# Altium project Pleiades_P01.PrjPcb (part 2 of 10)

## Sheet DDR3.SchDoc
size 558 x 431 mm; SheetNumber: 6; SheetTotal: 23; Sheet_Name: DDR3; Size: 11x17
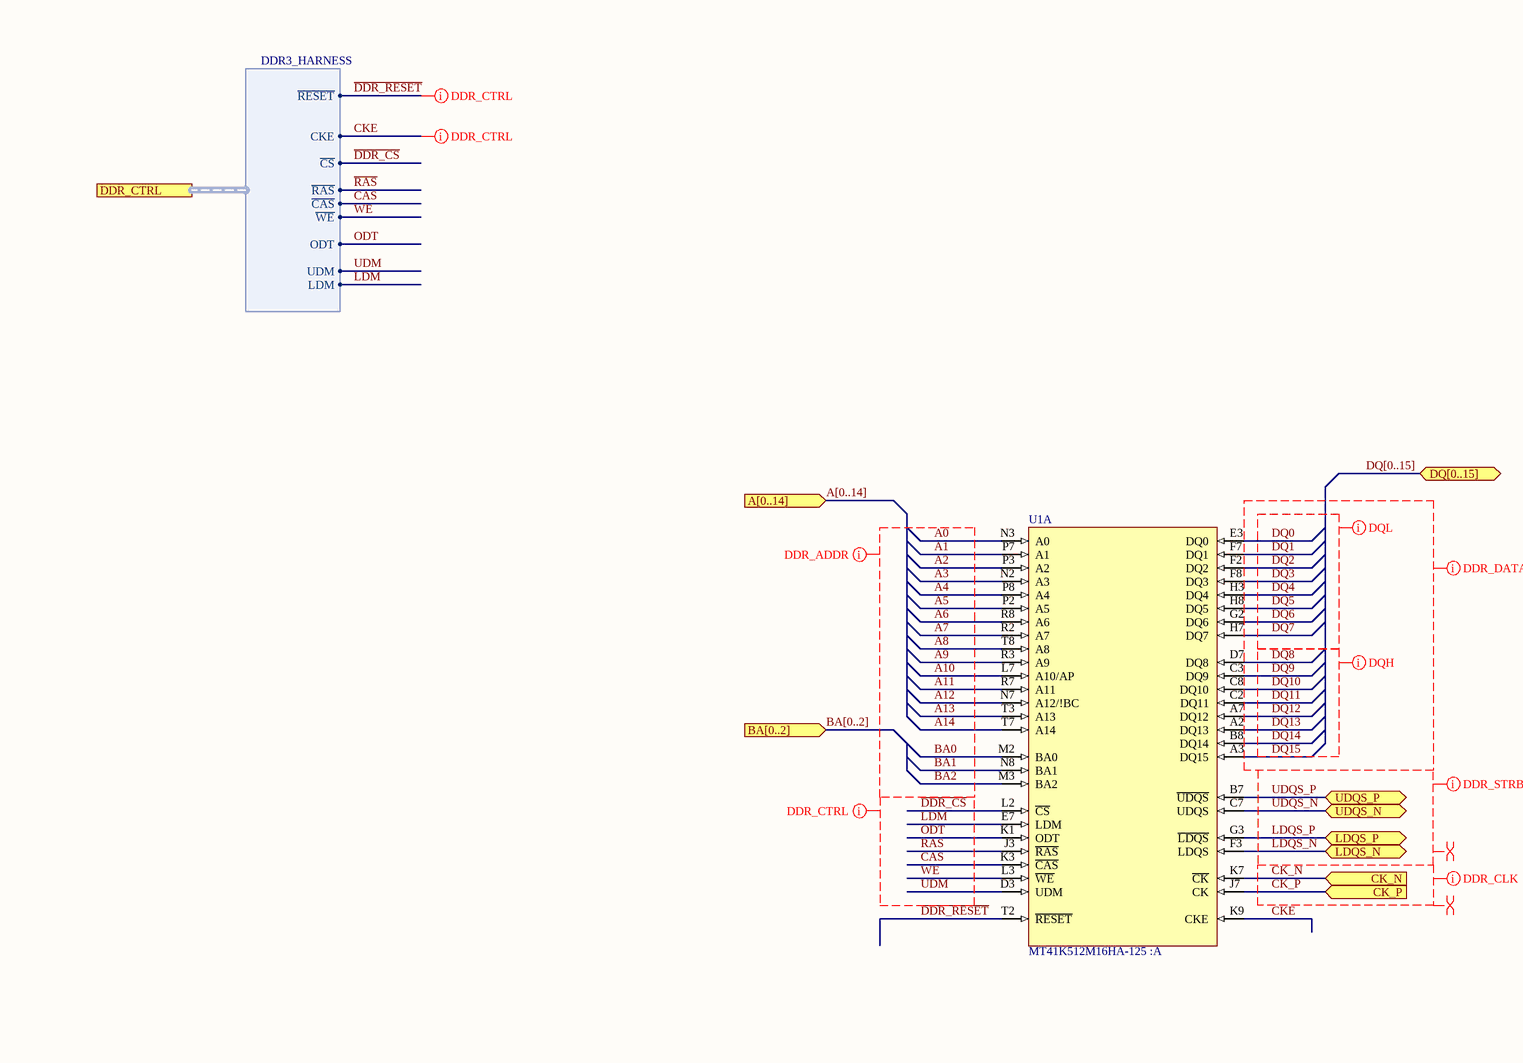
[diagram p10: DDR3.SchDoc, top left]
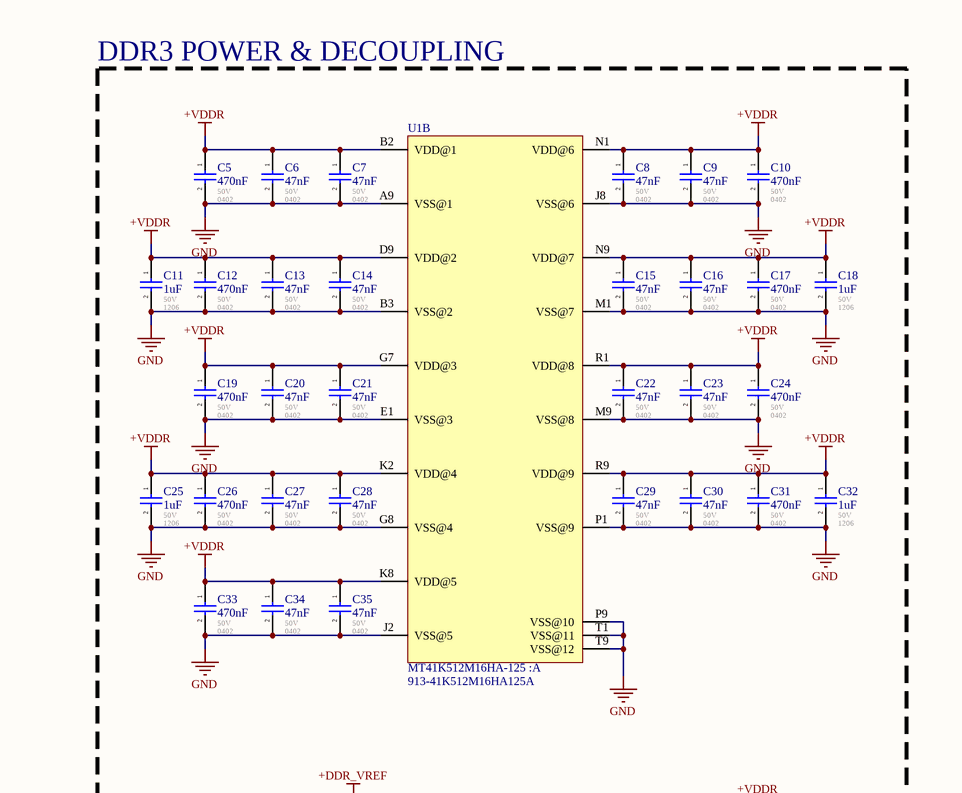
[diagram p11: DDR3.SchDoc, top right]
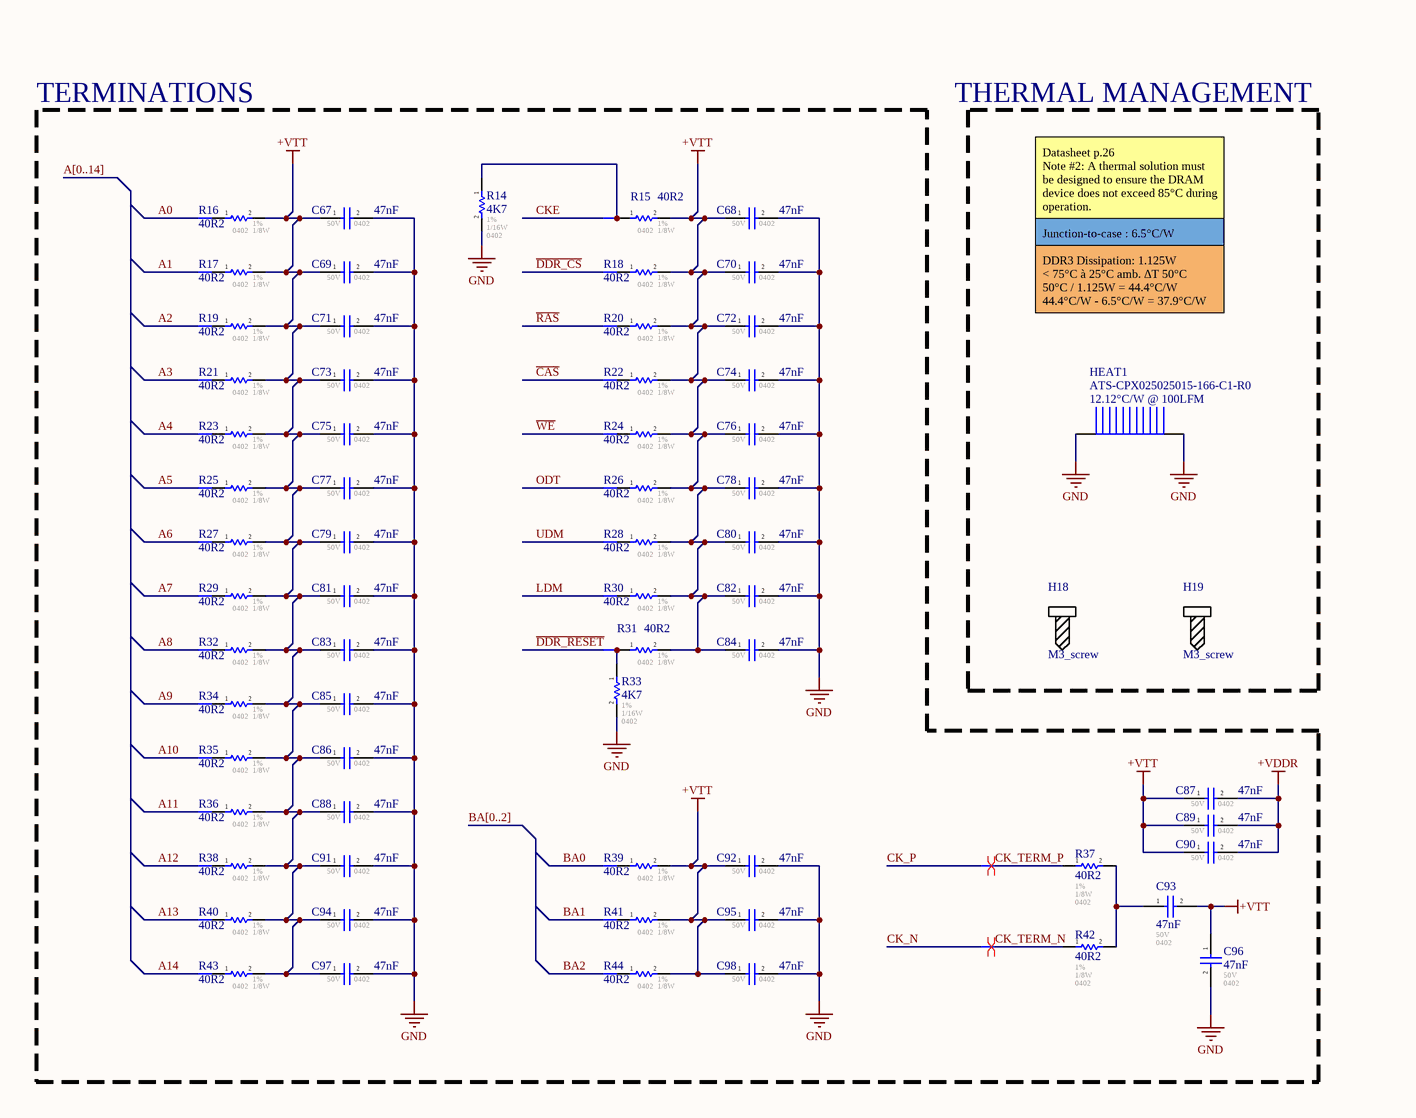
[diagram p12: DDR3.SchDoc, bottom left]
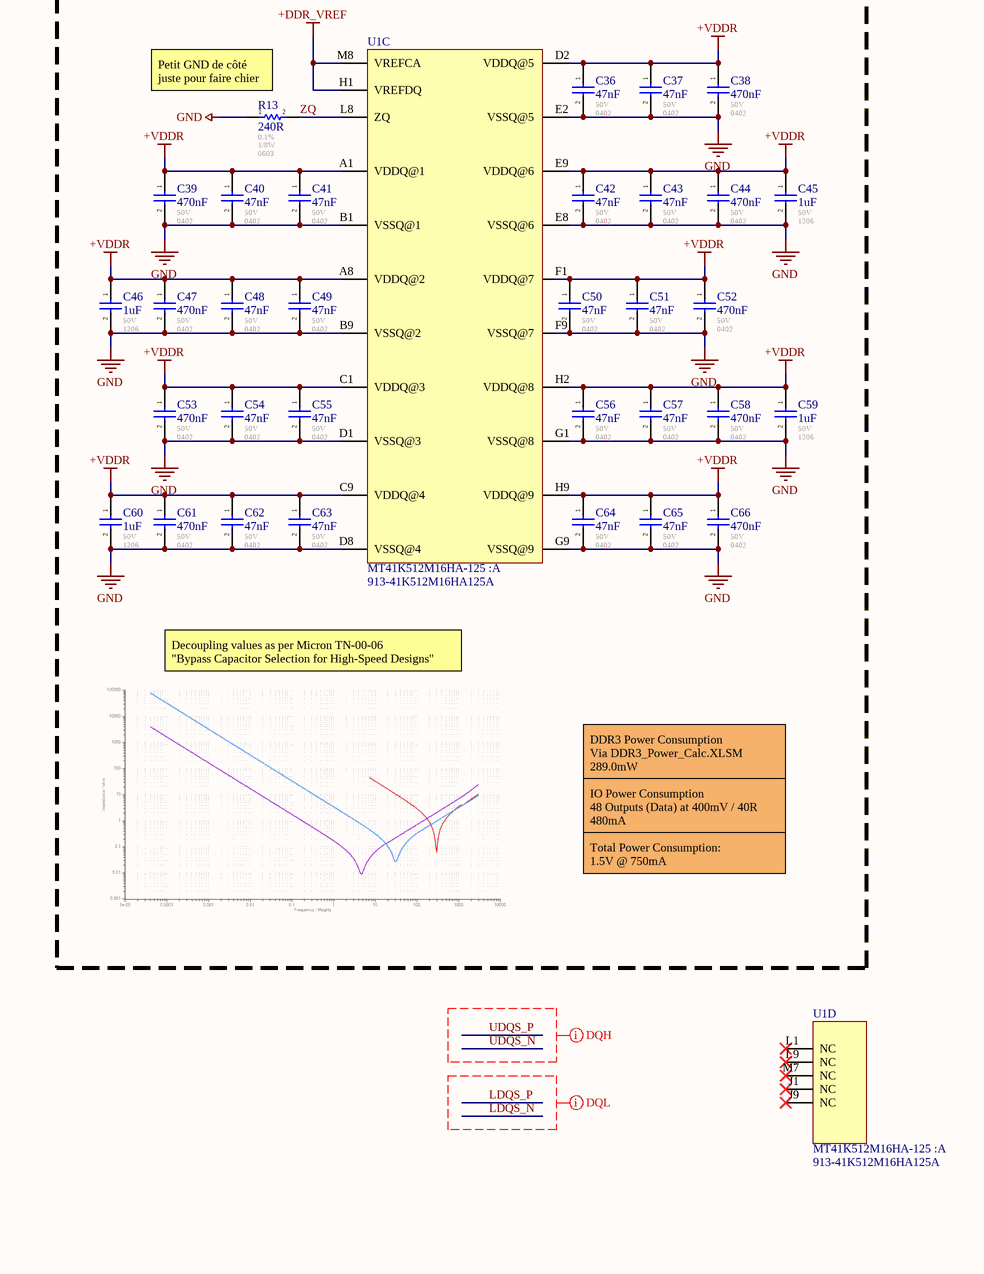
[diagram p13: DDR3.SchDoc, bottom right]

### Parts
C5  470nF  Voltage - Rated: 50V  Footprint: 0402  [CAP_0402]
C6  47nF  Voltage - Rated: 50V  Footprint: 0402  [CAP_0402]
C7  47nF  Voltage - Rated: 50V  Footprint: 0402  [CAP_0402]
C8  47nF  Voltage - Rated: 50V  Footprint: 0402  [CAP_0402]
C9  47nF  Voltage - Rated: 50V  Footprint: 0402  [CAP_0402]
C10  470nF  Voltage - Rated: 50V  Footprint: 0402  [CAP_0402]
C11  1uF  Voltage - Rated: 50V  Footprint: 1206  [CAP_1206]
C12  470nF  Voltage - Rated: 50V  Footprint: 0402  [CAP_0402]
C13  47nF  Voltage - Rated: 50V  Footprint: 0402  [CAP_0402]
C14  47nF  Voltage - Rated: 50V  Footprint: 0402  [CAP_0402]
C15  47nF  Voltage - Rated: 50V  Footprint: 0402  [CAP_0402]
C16  47nF  Voltage - Rated: 50V  Footprint: 0402  [CAP_0402]
C17  470nF  Voltage - Rated: 50V  Footprint: 0402  [CAP_0402]
C18  1uF  Voltage - Rated: 50V  Footprint: 1206  [CAP_1206]
C19  470nF  Voltage - Rated: 50V  Footprint: 0402  [CAP_0402]
C20  47nF  Voltage - Rated: 50V  Footprint: 0402  [CAP_0402]
C21  47nF  Voltage - Rated: 50V  Footprint: 0402  [CAP_0402]
C22  47nF  Voltage - Rated: 50V  Footprint: 0402  [CAP_0402]
C23  47nF  Voltage - Rated: 50V  Footprint: 0402  [CAP_0402]
C24  470nF  Voltage - Rated: 50V  Footprint: 0402  [CAP_0402]
C25  1uF  Voltage - Rated: 50V  Footprint: 1206  [CAP_1206]
C26  470nF  Voltage - Rated: 50V  Footprint: 0402  [CAP_0402]
C27  47nF  Voltage - Rated: 50V  Footprint: 0402  [CAP_0402]
C28  47nF  Voltage - Rated: 50V  Footprint: 0402  [CAP_0402]
C29  47nF  Voltage - Rated: 50V  Footprint: 0402  [CAP_0402]
C30  47nF  Voltage - Rated: 50V  Footprint: 0402  [CAP_0402]
C31  470nF  Voltage - Rated: 50V  Footprint: 0402  [CAP_0402]
C32  1uF  Voltage - Rated: 50V  Footprint: 1206  [CAP_1206]
C33  470nF  Voltage - Rated: 50V  Footprint: 0402  [CAP_0402]
C34  47nF  Voltage - Rated: 50V  Footprint: 0402  [CAP_0402]
C35  47nF  Voltage - Rated: 50V  Footprint: 0402  [CAP_0402]
C36  47nF  Voltage - Rated: 50V  Footprint: 0402  [CAP_0402]
C37  47nF  Voltage - Rated: 50V  Footprint: 0402  [CAP_0402]
C38  470nF  Voltage - Rated: 50V  Footprint: 0402  [CAP_0402]
C39  470nF  Voltage - Rated: 50V  Footprint: 0402  [CAP_0402]
C40  47nF  Voltage - Rated: 50V  Footprint: 0402  [CAP_0402]
C41  47nF  Voltage - Rated: 50V  Footprint: 0402  [CAP_0402]
C42  47nF  Voltage - Rated: 50V  Footprint: 0402  [CAP_0402]
C43  47nF  Voltage - Rated: 50V  Footprint: 0402  [CAP_0402]
C44  470nF  Voltage - Rated: 50V  Footprint: 0402  [CAP_0402]
C45  1uF  Voltage - Rated: 50V  Footprint: 1206  [CAP_1206]
C46  1uF  Voltage - Rated: 50V  Footprint: 1206  [CAP_1206]
C47  470nF  Voltage - Rated: 50V  Footprint: 0402  [CAP_0402]
C48  47nF  Voltage - Rated: 50V  Footprint: 0402  [CAP_0402]
C49  47nF  Voltage - Rated: 50V  Footprint: 0402  [CAP_0402]
C50  47nF  Voltage - Rated: 50V  Footprint: 0402  [CAP_0402]
C51  47nF  Voltage - Rated: 50V  Footprint: 0402  [CAP_0402]
C52  470nF  Voltage - Rated: 50V  Footprint: 0402  [CAP_0402]
C53  470nF  Voltage - Rated: 50V  Footprint: 0402  [CAP_0402]
C54  47nF  Voltage - Rated: 50V  Footprint: 0402  [CAP_0402]
C55  47nF  Voltage - Rated: 50V  Footprint: 0402  [CAP_0402]
C56  47nF  Voltage - Rated: 50V  Footprint: 0402  [CAP_0402]
C57  47nF  Voltage - Rated: 50V  Footprint: 0402  [CAP_0402]
C58  470nF  Voltage - Rated: 50V  Footprint: 0402  [CAP_0402]
C59  1uF  Voltage - Rated: 50V  Footprint: 1206  [CAP_1206]
C60  1uF  Voltage - Rated: 50V  Footprint: 1206  [CAP_1206]
C61  470nF  Voltage - Rated: 50V  Footprint: 0402  [CAP_0402]
C62  47nF  Voltage - Rated: 50V  Footprint: 0402  [CAP_0402]
C63  47nF  Voltage - Rated: 50V  Footprint: 0402  [CAP_0402]
C64  47nF  Voltage - Rated: 50V  Footprint: 0402  [CAP_0402]
C65  47nF  Voltage - Rated: 50V  Footprint: 0402  [CAP_0402]
C66  470nF  Voltage - Rated: 50V  Footprint: 0402  [CAP_0402]
C67  47nF  Voltage - Rated: 50V  Footprint: 0402  [CAP_0402]
C68  47nF  Voltage - Rated: 50V  Footprint: 0402  [CAP_0402]
C69  47nF  Voltage - Rated: 50V  Footprint: 0402  [CAP_0402]
C70  47nF  Voltage - Rated: 50V  Footprint: 0402  [CAP_0402]
C71  47nF  Voltage - Rated: 50V  Footprint: 0402  [CAP_0402]
C72  47nF  Voltage - Rated: 50V  Footprint: 0402  [CAP_0402]
C73  47nF  Voltage - Rated: 50V  Footprint: 0402  [CAP_0402]
C74  47nF  Voltage - Rated: 50V  Footprint: 0402  [CAP_0402]
C75  47nF  Voltage - Rated: 50V  Footprint: 0402  [CAP_0402]
C76  47nF  Voltage - Rated: 50V  Footprint: 0402  [CAP_0402]
C77  47nF  Voltage - Rated: 50V  Footprint: 0402  [CAP_0402]
C78  47nF  Voltage - Rated: 50V  Footprint: 0402  [CAP_0402]
C79  47nF  Voltage - Rated: 50V  Footprint: 0402  [CAP_0402]
C80  47nF  Voltage - Rated: 50V  Footprint: 0402  [CAP_0402]
C81  47nF  Voltage - Rated: 50V  Footprint: 0402  [CAP_0402]
C82  47nF  Voltage - Rated: 50V  Footprint: 0402  [CAP_0402]
C83  47nF  Voltage - Rated: 50V  Footprint: 0402  [CAP_0402]
C84  47nF  Voltage - Rated: 50V  Footprint: 0402  [CAP_0402]
C85  47nF  Voltage - Rated: 50V  Footprint: 0402  [CAP_0402]
C86  47nF  Voltage - Rated: 50V  Footprint: 0402  [CAP_0402]
C87  47nF  Voltage - Rated: 50V  Footprint: 0402  [CAP_0402]
C88  47nF  Voltage - Rated: 50V  Footprint: 0402  [CAP_0402]
C89  47nF  Voltage - Rated: 50V  Footprint: 0402  [CAP_0402]
C90  47nF  Voltage - Rated: 50V  Footprint: 0402  [CAP_0402]
C91  47nF  Voltage - Rated: 50V  Footprint: 0402  [CAP_0402]
C92  47nF  Voltage - Rated: 50V  Footprint: 0402  [CAP_0402]
C93  47nF  Voltage - Rated: 50V  Footprint: 0402  [CAP_0402]
C94  47nF  Voltage - Rated: 50V  Footprint: 0402  [CAP_0402]
C95  47nF  Voltage - Rated: 50V  Footprint: 0402  [CAP_0402]
C96  47nF  Voltage - Rated: 50V  Footprint: 0402  [CAP_0402]
C97  47nF  Voltage - Rated: 50V  Footprint: 0402  [CAP_0402]
C98  47nF  Voltage - Rated: 50V  Footprint: 0402  [CAP_0402]
H18  M3_screw  (mechanical)
H19  M3_screw  (mechanical)
HEAT1  ATS-CPX025025015-166-C1-R0  Thermal Resistance: 12.12°C/W @ 100LFM  [ATS-CPX025025015-166-C1-R0]
NT1  Net Tie  [NETTIE_9]  (value not drawn)  (net tie, no BOM)
NT2  Net Tie  [NETTIE_9]  (value not drawn)  (net tie, no BOM)
NT3  Net Tie  [NETTIE_9]  (value not drawn)  (net tie, no BOM)
NT4  Net Tie  [NETTIE_9]  (value not drawn)  (net tie, no BOM)
NT5  Net Tie  [NETTIE_9]  (value not drawn)  (net tie, no BOM)
NT6  Net Tie  [NETTIE_9]  (value not drawn)  (net tie, no BOM)
NT7  Net Tie  [NETTIE_9]  (value not drawn)  (net tie, no BOM)
NT8  Net Tie  [NETTIE_9]  (value not drawn)  (net tie, no BOM)
NT9  Net Tie  [NETTIE_9]  (value not drawn)  (net tie, no BOM)
NT10  Net Tie  [NETTIE_9]  (value not drawn)  (net tie, no BOM)
NT11  Net Tie  [NETTIE_9]  (value not drawn)  (net tie, no BOM)
NT12  Net Tie  [NETTIE_9]  (value not drawn)  (net tie, no BOM)
NT13  Net Tie  [NETTIE_9]  (value not drawn)  (net tie, no BOM)
NT14  Net Tie  [NETTIE_9]  (value not drawn)  (net tie, no BOM)
NT15  Net Tie  [NETTIE_9]  (value not drawn)  (net tie, no BOM)
NT16  Net Tie  [NETTIE_9]  (value not drawn)  (net tie, no BOM)
NT17  Net Tie  [NETTIE_9]  (value not drawn)  (net tie, no BOM)
NT18  Net Tie  [NETTIE_9]  (value not drawn)  (net tie, no BOM)
NT19  Net Tie  [NETTIE_9]  (value not drawn)  (net tie, no BOM)
NT20  Net Tie  [NETTIE_9]  (value not drawn)  (net tie, no BOM)
NT21  Net Tie  [NETTIE_9]  (value not drawn)  (net tie, no BOM)
NT22  Net Tie  [NETTIE_9]  (value not drawn)  (net tie, no BOM)
NT23  Net Tie  [NETTIE_9]  (value not drawn)  (net tie, no BOM)
NT24  Net Tie  [NETTIE_9]  (value not drawn)  (net tie, no BOM)
NT25  Net Tie  [NETTIE_9]  (value not drawn)  (net tie, no BOM)
NT26  Net Tie  [NETTIE_9]  (value not drawn)  (net tie, no BOM)
NT27  Net Tie  [NETTIE_9]  (value not drawn)  (net tie, no BOM)
NT28  Net Tie  [NETTIE_9]  (value not drawn)  (net tie, no BOM)
NT29  Net Tie  [NETTIE_9]  (value not drawn)  (net tie, no BOM)
R13  240R  Tolerance: 0.1%  Power: 1/8W  Package / Case: 0603  [RES_0603]
R14  4K7  Tolerance: 1%  Power: 1/16W  Package / Case: 0402  [RES_0402]
R15  40R2  Tolerance: 1%  Power: 1/8W  Package / Case: 0402  [RES_0402]
R16  40R2  Tolerance: 1%  Power: 1/8W  Package / Case: 0402  [RES_0402]
R17  40R2  Tolerance: 1%  Power: 1/8W  Package / Case: 0402  [RES_0402]
R18  40R2  Tolerance: 1%  Power: 1/8W  Package / Case: 0402  [RES_0402]
R19  40R2  Tolerance: 1%  Power: 1/8W  Package / Case: 0402  [RES_0402]
R20  40R2  Tolerance: 1%  Power: 1/8W  Package / Case: 0402  [RES_0402]
R21  40R2  Tolerance: 1%  Power: 1/8W  Package / Case: 0402  [RES_0402]
R22  40R2  Tolerance: 1%  Power: 1/8W  Package / Case: 0402  [RES_0402]
R23  40R2  Tolerance: 1%  Power: 1/8W  Package / Case: 0402  [RES_0402]
R24  40R2  Tolerance: 1%  Power: 1/8W  Package / Case: 0402  [RES_0402]
R25  40R2  Tolerance: 1%  Power: 1/8W  Package / Case: 0402  [RES_0402]
R26  40R2  Tolerance: 1%  Power: 1/8W  Package / Case: 0402  [RES_0402]
R27  40R2  Tolerance: 1%  Power: 1/8W  Package / Case: 0402  [RES_0402]
R28  40R2  Tolerance: 1%  Power: 1/8W  Package / Case: 0402  [RES_0402]
R29  40R2  Tolerance: 1%  Power: 1/8W  Package / Case: 0402  [RES_0402]
R30  40R2  Tolerance: 1%  Power: 1/8W  Package / Case: 0402  [RES_0402]
R31  40R2  Tolerance: 1%  Power: 1/8W  Package / Case: 0402  [RES_0402]
R32  40R2  Tolerance: 1%  Power: 1/8W  Package / Case: 0402  [RES_0402]
R33  4K7  Tolerance: 1%  Power: 1/16W  Package / Case: 0402  [RES_0402]
R34  40R2  Tolerance: 1%  Power: 1/8W  Package / Case: 0402  [RES_0402]
R35  40R2  Tolerance: 1%  Power: 1/8W  Package / Case: 0402  [RES_0402]
R36  40R2  Tolerance: 1%  Power: 1/8W  Package / Case: 0402  [RES_0402]
R37  40R2  Tolerance: 1%  Power: 1/8W  Package / Case: 0402  [RES_0402]
R38  40R2  Tolerance: 1%  Power: 1/8W  Package / Case: 0402  [RES_0402]
R39  40R2  Tolerance: 1%  Power: 1/8W  Package / Case: 0402  [RES_0402]
R40  40R2  Tolerance: 1%  Power: 1/8W  Package / Case: 0402  [RES_0402]
R41  40R2  Tolerance: 1%  Power: 1/8W  Package / Case: 0402  [RES_0402]
R42  40R2  Tolerance: 1%  Power: 1/8W  Package / Case: 0402  [RES_0402]
R43  40R2  Tolerance: 1%  Power: 1/8W  Package / Case: 0402  [RES_0402]
R44  40R2  Tolerance: 1%  Power: 1/8W  Package / Case: 0402  [RES_0402]
U1  MT41K512M16HA-125 :A  [FBGA-96]  (parts A,B,C,D of 4)

### Blocks framed on the sheet
DDR3 POWER & DECOUPLING: C5-C66 R13 U1

### Ports
A[0..14] (in), BA[0..2] (in), CK_N (in), CK_P (in), DDR_CTRL (harness DDR3_HARNESS), DQ[0..15] (bidir), LDQS_N (bidir), LDQS_P (bidir), UDQS_N (bidir), UDQS_P (bidir)

### Harnesses
DDR3_HARNESS: ~{RESET}, CKE, ~{CS}, ~{RAS}, ~{CAS}, ~{WE}, ODT, UDM, LDM

### Nets
+DDR_VREF: U1.H1(VREFDQ) U1.M8(VREFCA)
+VDDR: C5.1 C6.1 C7.1 C8.1 C9.1 C10.1 C11.1 C12.1 C13.1 C14.1 C15.1 C16.1 C17.1 C18.1 C19.1 C20.1 C21.1 C22.1 C23.1 C24.1 C25.1 C26.1 C27.1 C28.1 C29.1 C30.1 C31.1 C32.1 C33.1 C34.1 C35.1 C36.1 C37.1 C38.1 C39.1 C40.1 C41.1 C42.1 C43.1 C44.1 C45.1 C46.1 C47.1 C48.1 C49.1 C50.1 C51.1 C52.1 C53.1 C54.1 C55.1 C56.1 C57.1 C58.1 C59.1 C60.1 C61.1 C62.1 C63.1 C64.1 C65.1 C66.1 C87.2 C89.2 C90.2 U1.A1(VDDQ@1) U1.A8(VDDQ@2) U1.B2(VDD@1) U1.C1(VDDQ@3) U1.C9(VDDQ@4) U1.D2(VDDQ@5) U1.D9(VDD@2) U1.E9(VDDQ@6) U1.F1(VDDQ@7) U1.G7(VDD@3) U1.H2(VDDQ@8) U1.H9(VDDQ@9) U1.K2(VDD@4) U1.K8(VDD@5) U1.N1(VDD@6) U1.N9(VDD@7) U1.R1(VDD@8) U1.R9(VDD@9)
+VTT: C67.1 C68.1 C69.1 C70.1 C71.1 C72.1 C73.1 C74.1 C75.1 C76.1 C77.1 C78.1 C79.1 C80.1 C81.1 C82.1 C83.1 C84.1 C85.1 C86.1 C87.1 C88.1 C89.1 C90.1 C91.1 C92.1 C93.2 C94.1 C95.1 C96.1 C97.1 C98.1 R15.2 R16.2 R17.2 R18.2 R19.2 R20.2 R21.2 R22.2 R23.2 R24.2 R25.2 R26.2 R27.2 R28.2 R29.2 R30.2 R31.2 R32.2 R34.2 R35.2 R36.2 R38.2 R39.2 R40.2 R41.2 R43.2 R44.2
GND: C5.2 C6.2 C7.2 C8.2 C9.2 C10.2 C11.2 C12.2 C13.2 C14.2 C15.2 C16.2 C17.2 C18.2 C19.2 C20.2 C21.2 C22.2 C23.2 C24.2 C25.2 C26.2 C27.2 C28.2 C29.2 C30.2 C31.2 C32.2 C33.2 C34.2 C35.2 C36.2 C37.2 C38.2 C39.2 C40.2 C41.2 C42.2 C43.2 C44.2 C45.2 C46.2 C47.2 C48.2 C49.2 C50.2 C51.2 C52.2 C53.2 C54.2 C55.2 C56.2 C57.2 C58.2 C59.2 C60.2 C61.2 C62.2 C63.2 C64.2 C65.2 C66.2 C67.2 C68.2 C69.2 C70.2 C71.2 C72.2 C73.2 C74.2 C75.2 C76.2 C77.2 C78.2 C79.2 C80.2 C81.2 C82.2 C83.2 C84.2 C85.2 C86.2 C88.2 C91.2 C92.2 C94.2 C95.2 C96.2 C97.2 C98.2 HEAT1.1 HEAT1.2 R13.1 R14.2 R33.2 U1.A9(VSS@1) U1.B1(VSSQ@1) U1.B3(VSS@2) U1.B9(VSSQ@2) U1.D1(VSSQ@3) U1.D8(VSSQ@4) U1.E1(VSS@3) U1.E2(VSSQ@5) U1.E8(VSSQ@6) U1.F9(VSSQ@7) U1.G1(VSSQ@8) U1.G8(VSS@4) U1.G9(VSSQ@9) U1.J2(VSS@5) U1.J8(VSS@6) U1.M1(VSS@7) U1.M9(VSS@8) U1.P1(VSS@9) U1.P9(VSS@10) U1.T1(VSS@11) U1.T9(VSS@12)
~{CAS}: NT8.2 U1.K3(~{CAS}) ; port DDR_CTRL.~{CAS}
~{DDR_CS}: NT4.2 U1.L2(~{CS}) ; port DDR_CTRL.~{CS}
~{DDR_RESET}: NT18.2 U1.T2(~{RESET}) ; port DDR_CTRL.~{RESET}
~{RAS}: NT6.2 U1.J3(~{RAS}) ; port DDR_CTRL.~{RAS}
~{WE}: NT10.2 U1.L3(~{WE}) ; port DDR_CTRL.~{WE}
A0: NT1.2 U1.N3(A0)  [project net A0_6]
A1: NT3.2 U1.P7(A1)  [project net A1_6]
A2: NT5.2 U1.P3(A2)  [project net A2_6]
A3: NT7.2 U1.N2(A3)  [project net A3_6]
A4: NT9.2 U1.P8(A4)  [project net A4_6]
A5: NT11.2 U1.P2(A5)  [project net A5_6]
A6: NT13.2 U1.R8(A6)  [project net A6_6]
A7: NT15.2 U1.R2(A7)  [project net A7_6]
A8: NT17.2 U1.T8(A8)  [project net A8_6]
A9: NT19.2 U1.R3(A9)  [project net A9_6]
A10: NT20.2 U1.L7(A10/AP)  [project net A10_6]
A11: NT21.2 U1.R7(A11)  [project net A11_6]
A12: NT22.2 U1.N7(A12/!BC)  [project net A12_6]
A13: NT25.2 U1.T3(A13)  [project net A13_6]
A14: NT28.2 U1.T7(A14)  [project net A14_6]
BA0: NT23.2 U1.M2(BA0)  [project net BA0_6]
BA1: NT26.2 U1.N8(BA1)  [project net BA1_6]
BA2: NT29.2 U1.M3(BA2)  [project net BA2_6]
CK_N: NT27.2 U1.K7(~{CK}) ; port CK_N
CK_P: NT24.2 U1.J7(CK) ; port CK_P
CK_TERM_N: NT27.1 R42.1  [project net CK_TERM_N_6]
CK_TERM_P: NT24.1 R37.1  [project net CK_TERM_P_6]
CKE: NT2.2 U1.K9(CKE) ; port DDR_CTRL.CKE
DQ0: U1.E3(DQ0)  [project net DQ0_6]
DQ1: U1.F7(DQ1)  [project net DQ1_6]
DQ2: U1.F2(DQ2)  [project net DQ2_6]
DQ3: U1.F8(DQ3)  [project net DQ3_6]
DQ4: U1.H3(DQ4)  [project net DQ4_6]
DQ5: U1.H8(DQ5)  [project net DQ5_6]
DQ6: U1.G2(DQ6)  [project net DQ6_6]
DQ7: U1.H7(DQ7)  [project net DQ7_6]
DQ8: U1.D7(DQ8)  [project net DQ8_6]
DQ9: U1.C3(DQ9)  [project net DQ9_6]
DQ10: U1.C8(DQ10)  [project net DQ10_6]
DQ11: U1.C2(DQ11)  [project net DQ11_6]
DQ12: U1.A7(DQ12)  [project net DQ12_6]
DQ13: U1.A2(DQ13)  [project net DQ13_6]
DQ14: U1.B8(DQ14)  [project net DQ14_6]
DQ15: U1.A3(DQ15)  [project net DQ15_6]
LDM: NT16.2 U1.E7(LDM) ; port DDR_CTRL.LDM
LDQS_N: U1.F3(LDQS) ; port LDQS_N
LDQS_P: U1.G3(~{LDQS}) ; port LDQS_P
ODT: NT12.2 U1.K1(ODT) ; port DDR_CTRL.ODT
UDM: NT14.2 U1.D3(UDM) ; port DDR_CTRL.UDM
UDQS_N: U1.C7(UDQS) ; port UDQS_N
UDQS_P: U1.B7(~{UDQS}) ; port UDQS_P
ZQ: R13.2 U1.L8(ZQ)  [project net ZQ_6]
NetC93_1: C93.1 R37.2 R42.2
NetNT1_1: NT1.1 R16.1
NetNT2_1: NT2.1 R14.1 R15.1
NetNT3_1: NT3.1 R17.1
NetNT4_1: NT4.1 R18.1
NetNT5_1: NT5.1 R19.1
NetNT6_1: NT6.1 R20.1
NetNT7_1: NT7.1 R21.1
NetNT8_1: NT8.1 R22.1
NetNT9_1: NT9.1 R23.1
NetNT10_1: NT10.1 R24.1
NetNT11_1: NT11.1 R25.1
NetNT12_1: NT12.1 R26.1
NetNT13_1: NT13.1 R27.1
NetNT14_1: NT14.1 R28.1
NetNT15_1: NT15.1 R29.1
NetNT16_1: NT16.1 R30.1
NetNT17_1: NT17.1 R32.1
NetNT18_1: NT18.1 R31.1 R33.1
NetNT19_1: NT19.1 R34.1
NetNT20_1: NT20.1 R35.1
NetNT21_1: NT21.1 R36.1
NetNT22_1: NT22.1 R38.1
NetNT23_1: NT23.1 R39.1
NetNT25_1: NT25.1 R40.1
NetNT26_1: NT26.1 R41.1
NetNT28_1: NT28.1 R43.1
NetNT29_1: NT29.1 R44.1

Not connected (* = marked no-connect by the designer): U1 J1(NC)* J9(NC)* L1(NC)* L9(NC)* M7(NC)*

### Buses and harness runs
bus A[0..14]
bus A[0..14] = port A[0..14]
bus BA[0..2]
bus BA[0..2] = port BA[0..2]
bus DQ[0..15] = port DQ[0..15]

### Layout directives
net class DDR_CLK; net class ACC: CK_N, CK_P
differential pair: CK_N, CK_P, CK_TERM_N_6, CK_TERM_P_6, LDQS_N, LDQS_P, UDQS_N, UDQS_P
net class DDR_CLK; net class DDR_DATA: LDQS_N, LDQS_P, UDQS_N, UDQS_P
net class DDR_DATA: DQ0, DQ1, DQ2, DQ3, DQ4, DQ5, DQ6, DQ7, DQ8, DQ9, DQ10, DQ11, DQ12, DQ13, DQ14, DQ15
net class ACC; net class DDR_ADDR: A0, A1, A2, A3, A4, A5, A6, A7, A8, A9, A10, A11, A12, A13, A14, BA0, BA1, BA2
net class ACC: CKE, LDM, ODT, UDM, ~{CAS}, ~{DDR_CS}, ~{DDR_RESET}, ~{RAS}, ~{WE}
net class DQL: DQ0, DQ1, DQ2, DQ3, DQ4, DQ5, DQ6, DQ7, LDQS_N, LDQS_P
net class DQH: DQ8, DQ9, DQ10, DQ11, DQ12, DQ13, DQ14, DQ15, UDQS_N, UDQS_P

### Notes on the sheet
- (near R13) Petit GND de côté juste pour faire chier
- TERMINATIONS
- THERMAL MANAGEMENT
- Datasheet p.26
  Note #2: A thermal solution must be designed to ensure the DRAM device does not exceed 85°C during operation.
- Junction-to-case : 6.5°C/W
- DDR3 Dissipation: 1.125W
  < 75°C à 25°C amb. ΔT 50°C
  50°C / 1.125W = 44.4°C/W
  44.4°C/W - 6.5°C/W = 37.9°C/W
- Decoupling values as per Micron TN-00-06
  "Bypass Capacitor Selection for High-Speed Designs"
- DDR3 Power Consumption
  Via DDR3_Power_Calc.XLSM
  289.0mW
- IO Power Consumption
  48 Outputs (Data) at 400mV / 40R
  480mA
- Total Power Consumption:
  1.5V @ 750mA
- Sheet Name
- Project Title
- Global Project
- Revision
- Size
- Date
- Group
- Sheet
- of
- Filename
- Designers

### Library data of the parts
C5 C10 C12 C17 C19 C24 C26 C31 C33 C38 C39 C44 C47 C52 C53 C58 C61 C66 = CAP_CER: CGA3E3X7R1H474K080AB / 0603 470nF 10% X7R Ceramic Capacitor; Mfr: TDK; Operating Temperature: -55C - 125C; Temperature Coefficient: X7R; ComponentLink1Description: Digikey; ComponentLink1URL: [Digikey Link]; Part#: CGA3E3X7R1H474K080AB; ComponentLink2Description: Datasheet; ComponentLink2URL: [Datasheet Link]; Tolerance: 10%; Ratings: AEC-Q200
C6-C9 C13-C16 C20-C23 C27-C30 C34-C37 C40-C43 C48-C51 C54-C57 C62-C65 C67-C98 = CAP_CER: GCM155R71H473KE02J / 0402 47nF 10% X7R Ceramic Capacitor; Mfr: Murata; Operating Temperature: -55C - 125C; Temperature Coefficient: X7R; ComponentLink1Description: Digikey; ComponentLink1URL: [Digikey Link]; Part#: GCM155R71H473KE02J; ComponentLink2Description: Datasheet; ComponentLink2URL: [Datasheet Link]; Tolerance: 10%; Ratings: AEC-Q200
C11 C18 C25 C32 C45 C46 C59 C60 = CAP_CER: GCJ31CR71H105KA12L / 1206 1uF 10% X7R Ceramic Capacitor; Mfr: Murata; Operating Temperature: -55C - 125C; Temperature Coefficient: X7R; ComponentLink1Description: Digikey; ComponentLink1URL: [Digikey Link]; Part#: GCJ31CR71H105KA12L; ComponentLink2Description: Datasheet; ComponentLink2URL: [Datasheet Link]; Tolerance: 10%; Ratings: AEC-Q200
HEAT1 = HEATSINK_ATS-CPX025025015-166-C1-R0: Heatsink Aluminium; Mfr: Advanced Thermal Solutions Inc.; Hole Size: 3.175mm; Hole-to-hole: 42.42mm; Fin Height: 15mm; Length: 25mm; Width: 25mm; Material: Aluminium; ComponentLink1Description: Digikey; ComponentLink1URL: https://www.digikey.ca/en/products/detail/advanced-thermal-solutions-inc/ATS-CPX025025015-166-C1-R0/4753829; ComponentLink2Description: Mfr; ComponentLink2URL: https://www.qats.com/Search/HeatSink/2670.aspx; Supplier 1: Digikey; Supplier Part Number 1: ATS35911-ND
NT1-NT29 = NET_TIE_SMALL
R13-R44 = RESISTOR: Automotive: AEC-Q200; Operating Temperature: *; # Digikey: *; ComponentLink1Description: Digikey; ComponentLink1URL: *; # Manufacturer: *
U1 = IC_MT41K512M16HA-125: DRAM 8G 1.35V 512Mx16 800 MHz DDR3 0C-90C; Mfr: Alliance Memory; Data Bus Width: 16 bits; Memory Size: 8Gb; Maximum Clock Frequency: 800MHz; Supply Voltage (Max): 1.45V; Supply Voltage (Min): 1.283V; Supply Current (Max): 88mA; Package / Case: FBGA-96; Type: SDRAM - DDR3L; Memory Organization: 512M x 16; Operating Temperature: 0C - 95C; ComponentLink1Description: Digikey; ComponentLink1URL: https://www.digikey.ca/en/products/detail/alliance-memory-inc/MT41K512M16HA-125:A/10821776; ComponentLink2Description: Datasheet; ComponentLink2URL: https://media.digikey.com/pdf/Data%20Sheets/Micron%20Technology%20Inc%20PDFs/MT41K_2G4,1G8,512M16_8Gb_DDR3L.pdf; Digikey #: 1450-MT41K512M16HA-125:A-ND; Supplier 1: Mouser; Supplier Part Number 1: 913-41K512M16HA125A

## Sheet POWER.SchDoc
size Tabloid; SheetNumber: 17; SheetTotal: 23; Sheet_Name: POWER; Size: 11x17
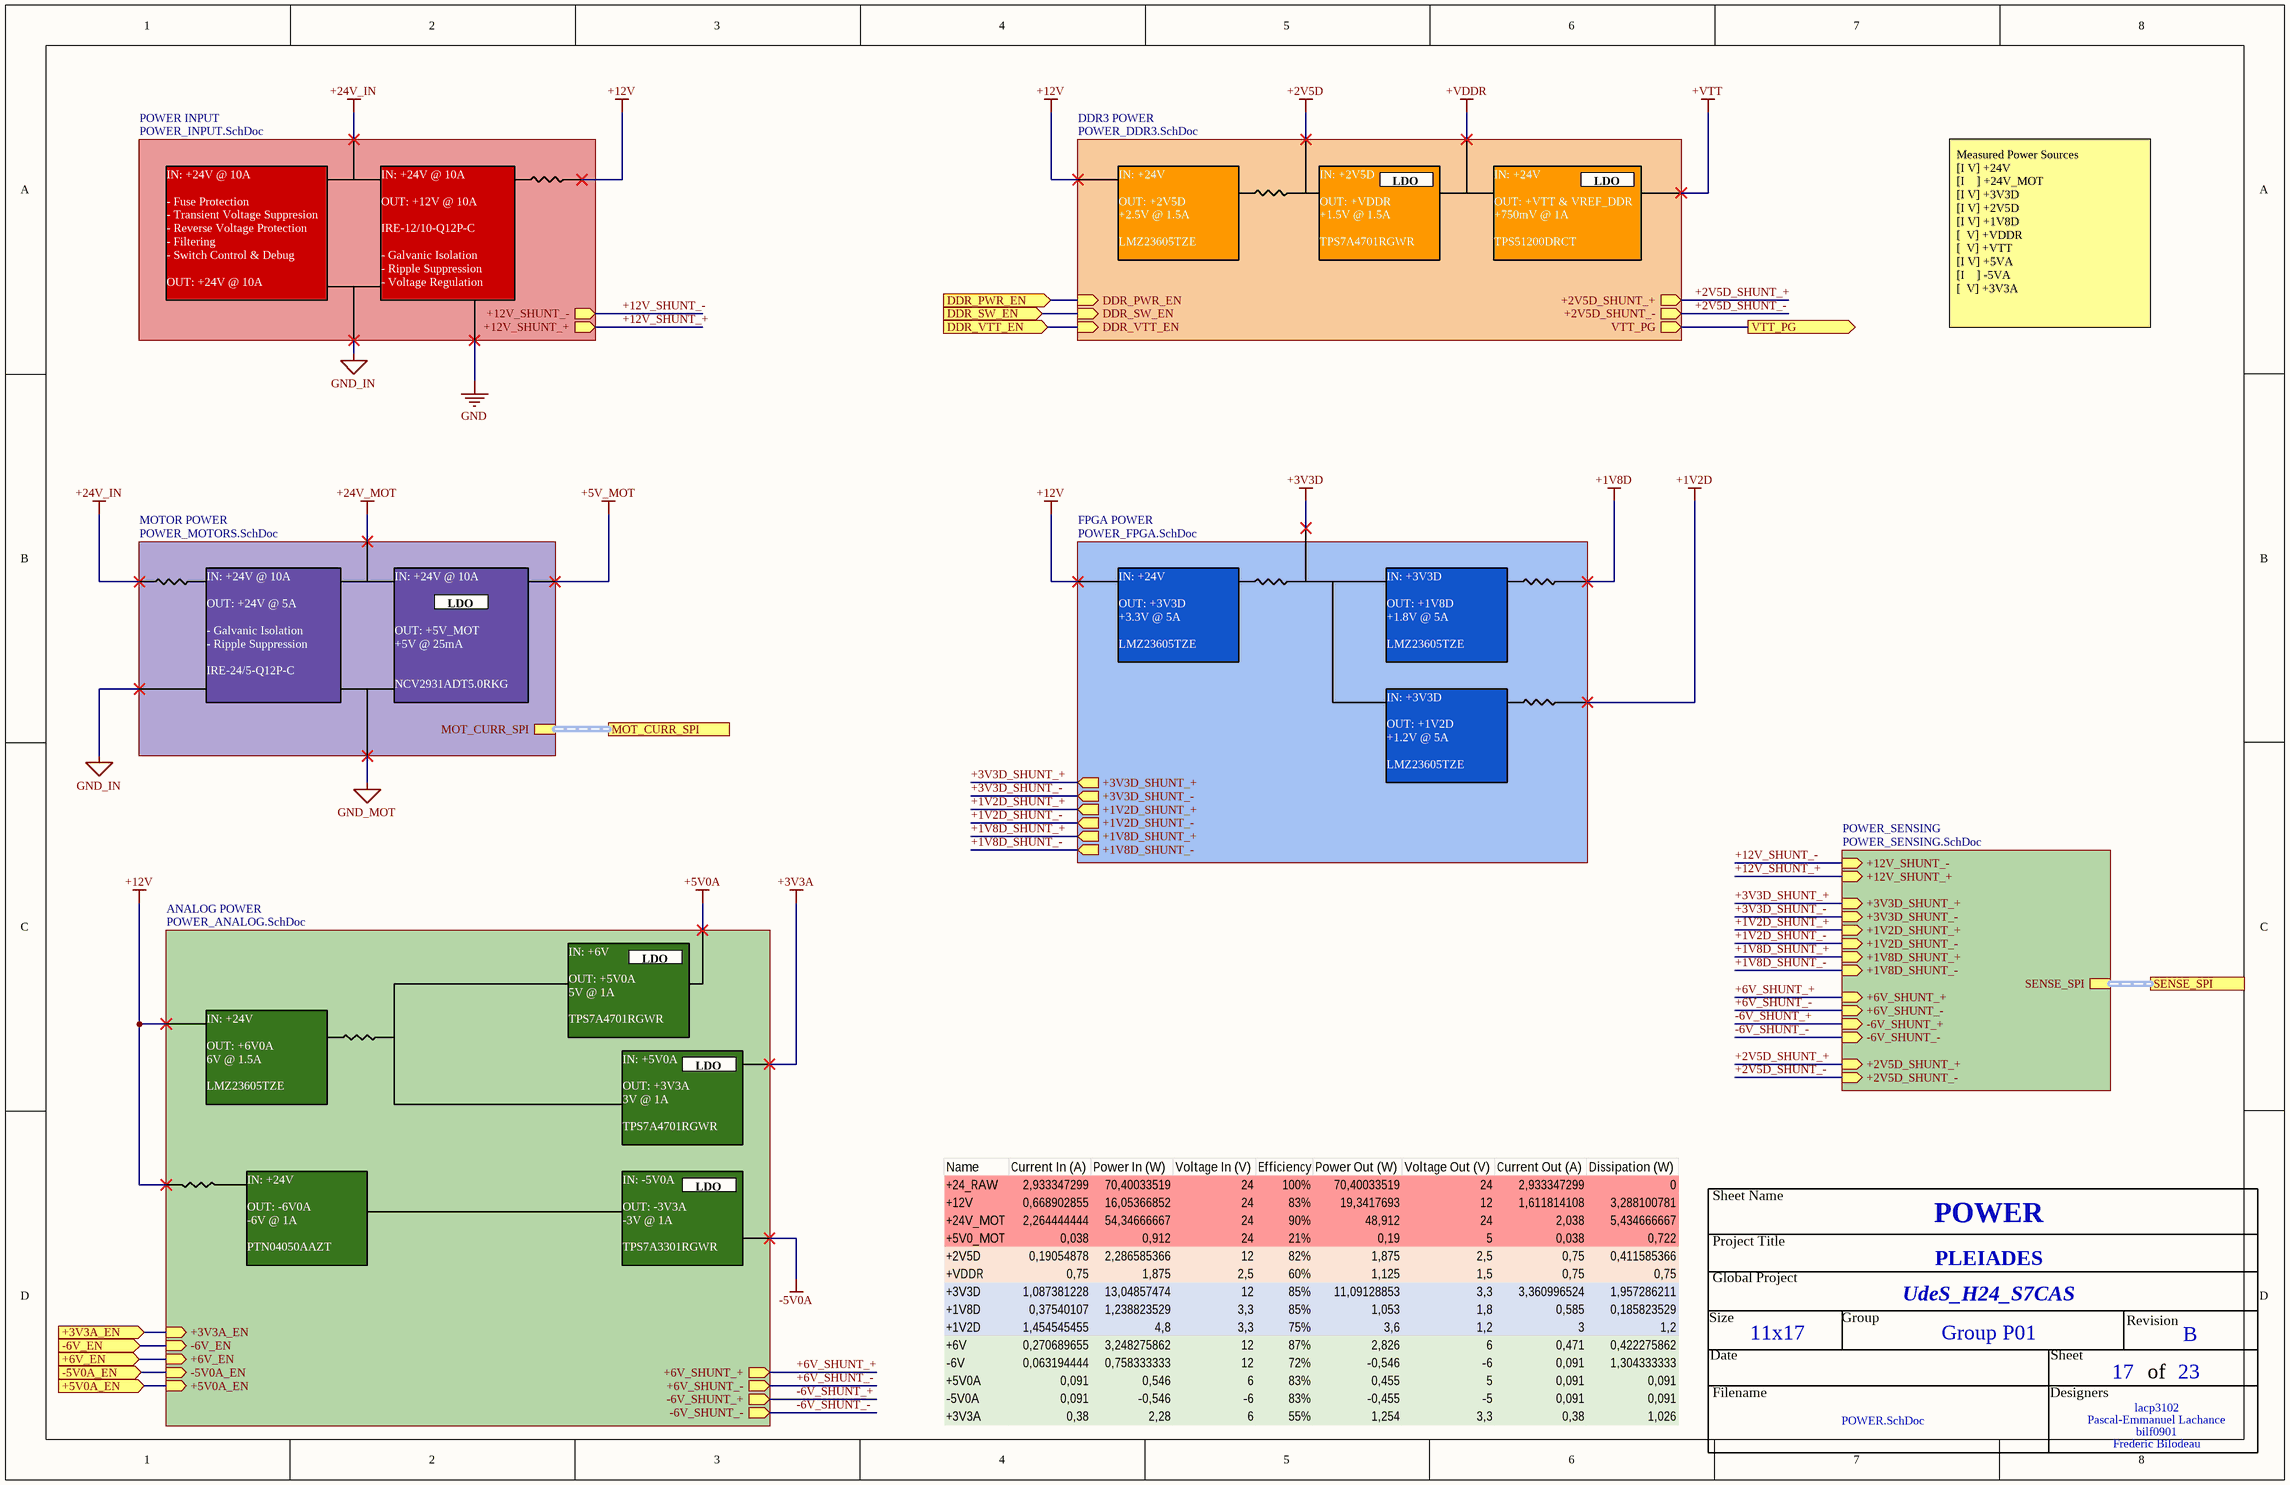
[diagram p14: POWER.SchDoc]

### Sub-sheets
ANALOG POWER = POWER_ANALOG.SchDoc: -6V_EN (in), +3V3A_EN (in), +5V0A_EN (in), -5V0A_EN (in), +6V_EN (in), +6V_SHUNT_+ (out), +6V_SHUNT_- (out), -6V_SHUNT_+ (out), -6V_SHUNT_- (out)
DDR3 POWER = POWER_DDR3.SchDoc: VTT_PG (out), DDR_PWR_EN (in), DDR_SW_EN (in), DDR_VTT_EN (in), +2V5D_SHUNT_+ (out), +2V5D_SHUNT_- (out)
FPGA POWER = POWER_FPGA.SchDoc: +3V3D_SHUNT_+ (out), +3V3D_SHUNT_- (out), +1V2D_SHUNT_+ (out), +1V2D_SHUNT_- (out), +1V8D_SHUNT_+ (out), +1V8D_SHUNT_- (out)
MOTOR POWER = POWER_MOTORS.SchDoc: MOT_CURR_SPI (harness MOT_CURR_SPI)
POWER INPUT = POWER_INPUT.SchDoc: +12V_SHUNT_+ (out), +12V_SHUNT_- (out)
POWER_SENSING = POWER_SENSING.SchDoc: SENSE_SPI (harness SENSE_SPI), +1V8D_SHUNT_- (in), +1V8D_SHUNT_+ (in), +1V2D_SHUNT_- (in), +1V2D_SHUNT_+ (in), +3V3D_SHUNT_- (in), +3V3D_SHUNT_+ (in), +6V_SHUNT_+ (in), +6V_SHUNT_- (in), -6V_SHUNT_+ (in), -6V_SHUNT_- (in), +12V_SHUNT_- (in), +12V_SHUNT_+ (in), +2V5D_SHUNT_+ (in), +2V5D_SHUNT_- (in)

### Ports
+3V3A_EN (in), +5V0A_EN (in), +6V_EN (in), -5V0A_EN (in), -6V_EN (in), DDR_PWR_EN (in), DDR_SW_EN (in), DDR_VTT_EN (in), MOT_CURR_SPI (harness MOT_CURR_SPI), SENSE_SPI (harness SENSE_SPI), VTT_PG (out)

### Nets
+1V2D_SHUNT_+: sheet FPGA POWER/+1V2D_SHUNT_+, sheet POWER_SENSING/+1V2D_SHUNT_+
+1V2D_SHUNT_-: sheet FPGA POWER/+1V2D_SHUNT_-, sheet POWER_SENSING/+1V2D_SHUNT_-
+1V8D_SHUNT_+: sheet FPGA POWER/+1V8D_SHUNT_+, sheet POWER_SENSING/+1V8D_SHUNT_+
+1V8D_SHUNT_-: sheet FPGA POWER/+1V8D_SHUNT_-, sheet POWER_SENSING/+1V8D_SHUNT_-
+2V5D_SHUNT_+: sheet DDR3 POWER/+2V5D_SHUNT_+, sheet POWER_SENSING/+2V5D_SHUNT_+
+2V5D_SHUNT_-: sheet DDR3 POWER/+2V5D_SHUNT_-, sheet POWER_SENSING/+2V5D_SHUNT_-
+3V3A_EN: port +3V3A_EN, sheet ANALOG POWER/+3V3A_EN
+3V3D_SHUNT_+: sheet FPGA POWER/+3V3D_SHUNT_+, sheet POWER_SENSING/+3V3D_SHUNT_+
+3V3D_SHUNT_-: sheet FPGA POWER/+3V3D_SHUNT_-, sheet POWER_SENSING/+3V3D_SHUNT_-
+5V0A_EN: port +5V0A_EN, sheet ANALOG POWER/+5V0A_EN
+6V_EN: port +6V_EN, sheet ANALOG POWER/+6V_EN
+6V_SHUNT_+: sheet ANALOG POWER/+6V_SHUNT_+, sheet POWER_SENSING/+6V_SHUNT_+
+6V_SHUNT_-: sheet ANALOG POWER/+6V_SHUNT_-, sheet POWER_SENSING/+6V_SHUNT_-
+12V_SHUNT_+: sheet POWER INPUT/+12V_SHUNT_+, sheet POWER_SENSING/+12V_SHUNT_+
+12V_SHUNT_-: sheet POWER INPUT/+12V_SHUNT_-, sheet POWER_SENSING/+12V_SHUNT_-
-5V0A_EN: port -5V0A_EN, sheet ANALOG POWER/-5V0A_EN
-6V_EN: port -6V_EN, sheet ANALOG POWER/-6V_EN
-6V_SHUNT_+: sheet ANALOG POWER/-6V_SHUNT_+, sheet POWER_SENSING/-6V_SHUNT_+
-6V_SHUNT_-: sheet ANALOG POWER/-6V_SHUNT_-, sheet POWER_SENSING/-6V_SHUNT_-
DDR_PWR_EN: port DDR_PWR_EN, sheet DDR3 POWER/DDR_PWR_EN
DDR_SW_EN: port DDR_SW_EN, sheet DDR3 POWER/DDR_SW_EN
DDR_VTT_EN: port DDR_VTT_EN, sheet DDR3 POWER/DDR_VTT_EN
VTT_PG: port VTT_PG, sheet DDR3 POWER/VTT_PG

### Buses and harness runs
harness port MOT_CURR_SPI = sheet MOTOR POWER/MOT_CURR_SPI
harness port SENSE_SPI = sheet POWER_SENSING/SENSE_SPI

### Notes on the sheet
- LDO
- IN: +24V @ 10A
  - Fuse Protection
  - Transient Voltage Suppresion
  - Reverse Voltage Protection
  - Filtering
  - Switch Control & Debug
  OUT: +24V @ 10A
- IN: +24V @ 10A
  OUT: +12V @ 10A
  IRE-12/10-Q12P-C
  - Galvanic Isolation
  - Ripple Suppression
  - Voltage Regulation
- IN: +24V
  OUT: +2V5D
  +2.5V @ 1.5A
  LMZ23605TZE
- IN: +2V5D
  OUT: +VDDR
  +1.5V @ 1.5A
  TPS7A4701RGWR
- IN: +24V
  OUT: +VTT & VREF_DDR
  +750mV @ 1A
  TPS51200DRCT
- Measured Power Sources
  [I V] +24V
  [I    ] +24V_MOT
  [I V] +3V3D
  [I V] +2V5D
  [I V] +1V8D
  [  V] +VDDR
  [  V] +VTT
  [I V] +5VA
  [I    ] -5VA
  [  V] +3V3A
- IN: +24V @ 10A
  OUT: +24V @ 5A
  - Galvanic Isolation
  - Ripple Suppression
  IRE-24/5-Q12P-C
- IN: +24V @ 10A
  OUT: +5V_MOT
  +5V @ 25mA
  NCV2931ADT5.0RKG
- IN: +24V
  OUT: +3V3D
  +3.3V @ 5A
  LMZ23605TZE
- IN: +3V3D
  OUT: +1V8D
  +1.8V @ 5A
  LMZ23605TZE
- IN: +3V3D
  OUT: +1V2D
  +1.2V @ 5A
  LMZ23605TZE
- IN: +6V
  OUT: +5V0A
  5V @ 1A
  TPS7A4701RGWR
- IN: +24V
  OUT: +6V0A
  6V @ 1.5A
  LMZ23605TZE
- IN: +5V0A
  OUT: +3V3A
  3V @ 1A
  TPS7A4701RGWR
- IN: +24V
  OUT: -6V0A
  -6V @ 1A
  PTN04050AAZT
- IN: -5V0A
  OUT: -3V3A
  -3V @ 1A
  TPS7A3301RGWR
- Sheet Name
- Project Title
- Global Project
- Revision
- Size
- Date
- Group
- Sheet
- of
- Filename
- Designers

## Sheet POWER_INPUT.SchDoc
size Tabloid; SheetNumber: 20; SheetTotal: 25; Sheet_Name: POWER INPUT; Size: 11x17
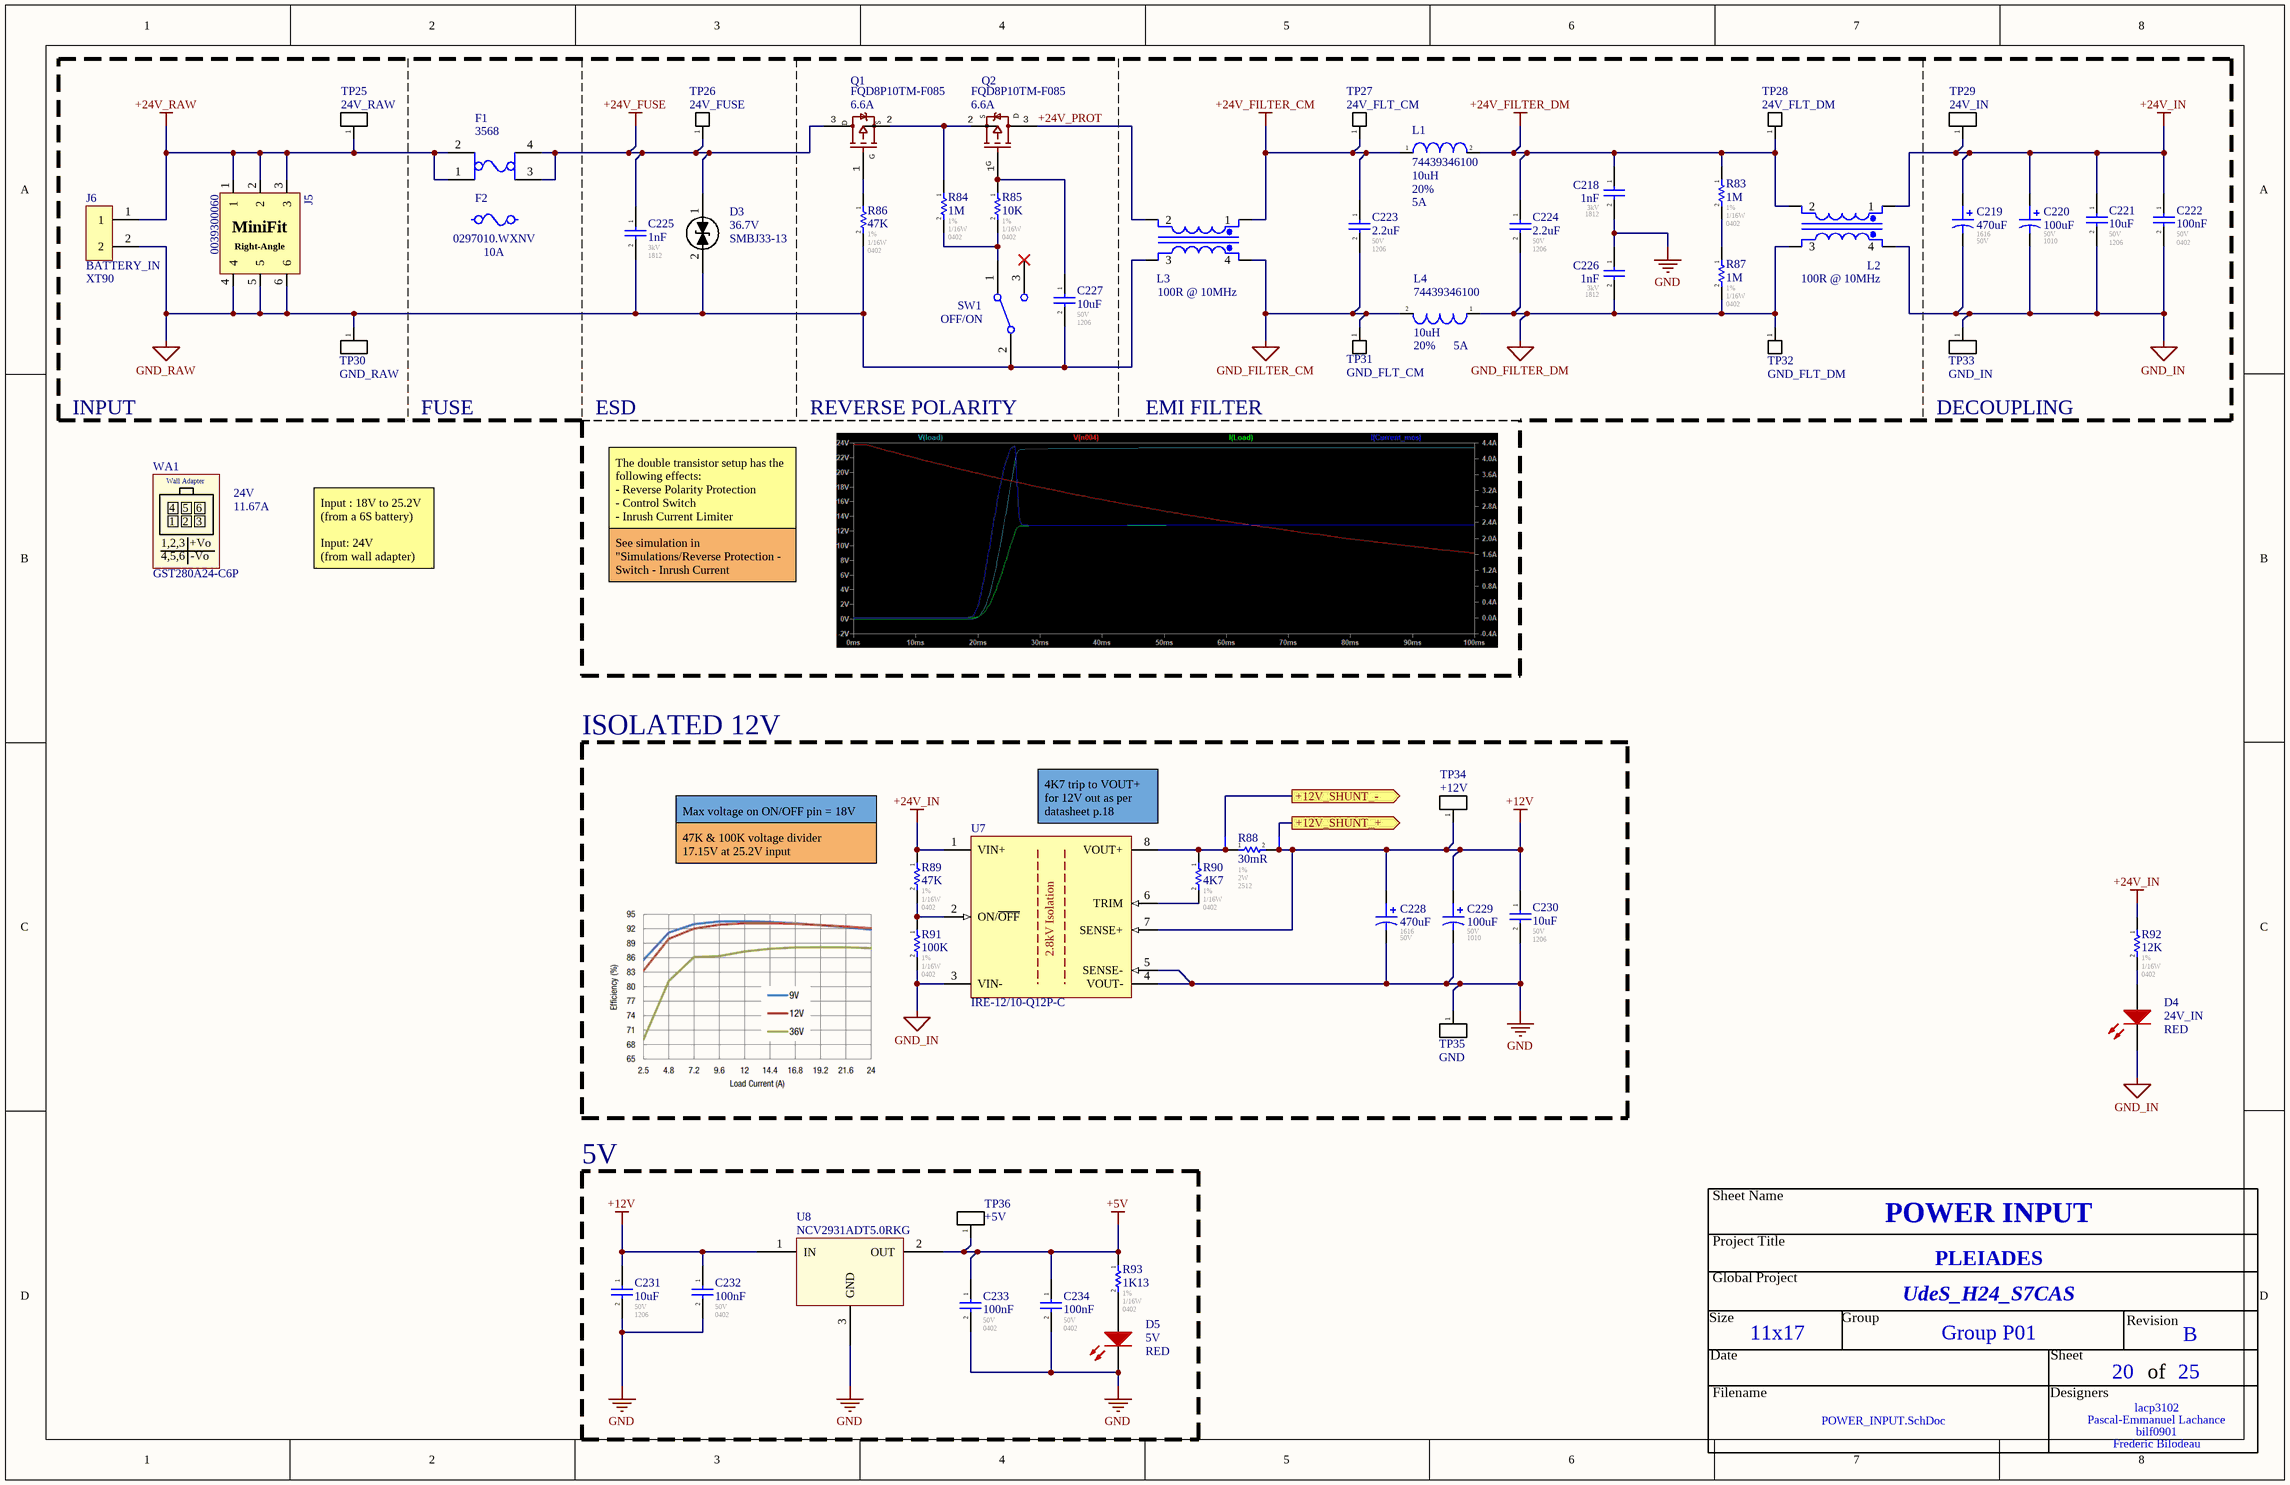
[diagram p15: POWER_INPUT.SchDoc]

### Parts
C218  1nF  Voltage - Rated: 3kV  Footprint: 1812  [CAP_1812]
C219  value 470uF  Voltage: 50V  Package: 1616  [CAP_ALU_1616_vishay]  (hidden comment: MAL214699108E3)
C220  value 100uF  Voltage: 50V  Package: 1010  [CAP_ALU_1010_vishay]  (hidden comment: MAL215099101E3)
C221  10uF  Voltage - Rated: 50V  Footprint: 1206  [CAP_1206]
C222  100nF  Voltage - Rated: 50V  Footprint: 0402  [CAP_0402]
C223  2.2uF  Voltage - Rated: 50V  Footprint: 1206  [CAP_1206]
C224  2.2uF  Voltage - Rated: 50V  Footprint: 1206  [CAP_1206]
C225  1nF  Voltage - Rated: 3kV  Footprint: 1812  [CAP_1812]
C226  1nF  Voltage - Rated: 3kV  Footprint: 1812  [CAP_1812]
C227  10uF  Voltage - Rated: 50V  Footprint: 1206  [CAP_1206]
C228  value 470uF  Voltage: 50V  Package: 1616  [CAP_ALU_1616_vishay]  (hidden comment: MAL214699108E3)
C229  value 100uF  Voltage: 50V  Package: 1010  [CAP_ALU_1010_vishay]  (hidden comment: MAL215099101E3)
C230  10uF  Voltage - Rated: 50V  Footprint: 1206  [CAP_1206]
C231  10uF  Voltage - Rated: 50V  Footprint: 1206  [CAP_1206]
C232  100nF  Voltage - Rated: 50V  Footprint: 0402  [CAP_0402]
C233  100nF  Voltage - Rated: 50V  Footprint: 0402  [CAP_0402]
C234  100nF  Voltage - Rated: 50V  Footprint: 0402  [CAP_0402]
D3  SMBJ33-13  Voltage - Breakdown: 36.7V  [DO214AA (SMB)]
D4  24V_IN  value RED  [LED_0603]
D5  5V  value RED  [LED_0603]
F1  3568  [3568]
F2  0297010.WXNV  Current - Trip: 10A  [0297010.WXNV]
J5  0039300060  [CON_MINIFIT_0039300060]
J6  BATTERY_IN  [XT90]
L1  74439346100  Inductance: 10uH  Tolerance: 20%  Current Rating: 5A  [74439346100]
L2  value 100R @ 10MHz  [IND_PLT10HH101150PNL]  (hidden comment: PLT10HH101150PNL)
L3  value 100R @ 10MHz  [IND_PLT10HH101150PNL]  (hidden comment: PLT10HH101150PNL)
L4  74439346100  Inductance: 10uH  Tolerance: 20%  Current Rating: 5A  [74439346100]
NT38  Net Tie  [NETTIE_5]  (value not drawn)  (net tie, no BOM)
NT39  Net Tie  [NETTIE_5]  (value not drawn)  (net tie, no BOM)
Q1  FQD8P10TM-F085  Current: 6.6A  [DPAK]
Q2  FQD8P10TM-F085  Current: 6.6A  [DPAK]
R83  1M  Tolerance: 1%  Power: 1/16W  Package / Case: 0402  [RES_0402]
R84  1M  Tolerance: 1%  Power: 1/16W  Package / Case: 0402  [RES_0402]
R85  10K  Tolerance: 1%  Power: 1/16W  Package / Case: 0402  [RES_0402]
R86  47K  Tolerance: 1%  Power: 1/16W  Package / Case: 0402  [RES_0402]
R87  1M  Tolerance: 1%  Power: 1/16W  Package / Case: 0402  [RES_0402]
R88  30mR  Tolerance: 1%  Power: 2W  Package / Case: 2512  [RES_2512]
R89  47K  Tolerance: 1%  Power: 1/16W  Package / Case: 0402  [RES_0402]
R90  4K7  Tolerance: 1%  Power: 1/16W  Package / Case: 0402  [RES_0402]
R91  100K  Tolerance: 1%  Power: 1/16W  Package / Case: 0402  [RES_0402]
R92  12K  Tolerance: 1%  Power: 1/16W  Package / Case: 0402  [RES_0402]
R93  1K13  Tolerance: 1%  Power: 1/16W  Package / Case: 0402  [RES_0402]
SW1  OFF/ON  [1101M2S3CQE2]
TP25  24V_RAW  [TP_HOLE]  (no BOM)
TP26  24V_FUSE  [TP_PAD]  (no BOM)
TP27  24V_FLT_CM  [TP_PAD]  (no BOM)
TP28  24V_FLT_DM  [TP_PAD]  (no BOM)
TP29  24V_IN  [TP_HOLE]  (no BOM)
TP30  GND_RAW  [TP_HOLE]  (no BOM)
TP31  GND_FLT_CM  [TP_PAD]  (no BOM)
TP32  GND_FLT_DM  [TP_PAD]  (no BOM)
TP33  GND_IN  [TP_HOLE]  (no BOM)
TP34  +12V  [TP_HOLE]  (no BOM)
TP35  GND  [TP_HOLE]  (no BOM)
TP36  +5V  [TP_HOLE]  (no BOM)
U7  IRE-12/10-Q12P-C  [IRE-Q12]
U8  NCV2931ADT5.0RKG  [DPAK]
WA1  GST280A24-C6P  value 24V  Current Rating: 11.67A  [Model Name]  (mechanical)

### Blocks framed on the sheet
ISOLATED 12V: C228-C230 NT38 NT39 R88-R91 TP34 TP35 U7
5V: C231-C234 D5 R93 TP36 U8

### Ports
+12V_SHUNT_+ (out), +12V_SHUNT_- (out)

### Nets
+5V: C233.1 C234.1 R93.1 TP36.1(A) U8.2(OUT)
+12V: C228.1 C229.1 C230.1 C231.1 C232.1 NT39.1 R88.2 TP34.1(A) U7.7(SENSE+) U8.1(IN)
+24V_FILTER_CM: C223.1 L1.1 L3.1 TP27.1(A)
+24V_FILTER_DM: C218.1 C224.1 L1.2 L2.2 R83.1 TP28.1(A)
+24V_FUSE: C225.1 D3.1(A) F1.3 F1.4 Q1.3 TP26.1(A)
+24V_IN: C219.1 C220.1 C221.1 C222.1 L2.1 R89.1 R92.1 TP29.1(A) U7.1(VIN+)
+24V_RAW: F1.1 F1.2 J5.1 J5.2 J5.3 J6.1 TP25.1(A)
GND: C218.2 C226.1 C228.2 C229.2 C230.2 C231.2 C232.2 C233.2 C234.2 D5.2(K) TP35.1(A) U7.4(VOUT-) U7.5(SENSE-) U8.3(GND)
GND_FILTER_CM: C223.2 L3.4 L4.2 TP31.1(A)
GND_FILTER_DM: C224.2 C226.2 L2.3 L4.1 R87.2 TP32.1(A)
GND_IN: C219.2 C220.2 C221.2 C222.2 D4.2(K) L2.4 R91.2 TP33.1(A) U7.3(VIN-)
GND_RAW: C225.2 C227.2 D3.2(C) J5.4 J5.5 J5.6 J6.2 L3.3 R86.2 SW1.2(P) TP30.1(A)
+12V_SHUNT_+: NT39.2 ; port +12V_SHUNT_+
+12V_SHUNT_-: NT38.2 ; port +12V_SHUNT_-
+24V_PROT: L3.2 Q2.3  [project net +24V_PROT_20]
NetC227_1: C227.1 Q2.1 R85.1
NetD4_1: D4.1(A) R92.2
NetD5_1: D5.1(A) R93.2
NetNT38_1: NT38.1 R88.1 R90.1 U7.8(VOUT+)
NetQ1_1: Q1.1 R86.1
NetQ1_2: Q1.2 Q2.2 R84.1
NetR83_2: R83.2 R87.1
NetR84_2: R84.2 R85.2 SW1.1(A)
NetR89_2: R89.2 R91.1 U7.2(ON/~{OFF})
NetR90_2: R90.2 U7.6(TRIM)

Not connected (* = marked no-connect by the designer): SW1 3(B)*

### Notes on the sheet
- INPUT
- FUSE
- ESD
- REVERSE POLARITY
- EMI FILTER
- DECOUPLING
- Input : 18V to 25.2V
  (from a 6S battery)
  Input: 24V
  (from wall adapter)
- The double transistor setup has the following effects:
  - Reverse Polarity Protection
  - Control Switch
  - Inrush Current Limiter
- See simulation in "Simulations/Reverse Protection - Switch - Inrush Current Protection.asc"
- Max voltage on ON/OFF pin = 18V
- (near U7) 4K7 trip to VOUT+ for 12V out as per datasheet p.18
- (near R89) 47K & 100K voltage divider
  17.15V at 25.2V input
- Sheet Name
- Project Title
- Global Project
- Revision
- Size
- Date
- Group
- Sheet
- of
- Filename
- Designers
- (in symbol CON_MINIFIT_0039300060) MiniFit; Right-Angle
- (in symbol IRE-24/5-Q12P-C) 2.8kV Isolation
- (in symbol P_CHANNEL) D; S; G
- (in symbol UND_GST280A24-C6P) Wall Adapter; 4; 5; 6; 1; 2; 3; 1,2,3; +Vo; 4,5,6; -Vo

### Library data of the parts
C218 C225 C226 = CAP_CER: C1812C102KHRACAUTO / 0402 470pF 10% X7R Ceramic Capacitor; Mfr: KEMET; Operating Temperature: -55C - 125C; Temperature Coefficient: X7R; ComponentLink1Description: Digikey; ComponentLink1URL: https://www.digikey.com/en/products/detail/kemet/C1812C102KHRACAUTO/8109956; Part#: C1812C102KHRACAUTO; ComponentLink2Description: Datasheet; ComponentLink2URL: https://connect.kemet.com:7667/gateway/IntelliData-ComponentDocumentation/1.0/download/datasheet/C1812C102KHRACAUTO; Tolerance: 10%; Ratings: AEC-Q200; ComponentLink3Description: KEMET; ComponentLink3URL: https://www.kemet.com/en/us/capacitors/ceramic/product/C1812C102KHRACAUTO.html; ComponentLink4Description: Octopart; ComponentLink4URL: https://octopart.com/c1812c102khracauto-kemet-67309371?r=sp; Features: Low ESL, High Voltage; Supplier 1: Mouser; Supplier Part Number 1: 80-C1812C102KHRAUTO
C219 C228 = CAP_ALU_MAL214699108E3: CAP - ALU 470uF 20% 50V - 1616; Current: 1.3A; Mfg: Vishay Dale; Mfg Part Number: MAL214699108E3; HelpURL: http://www.vishay.com/docs/28403/146cti.pdf; CreatedBy: Jonathan Bouchard; Temperature: -55°C to 125°C; Power: *; Supplier 1: Digikey; Supplier Part Number 1: 4442PHCT-ND; Precision: 20%
C220 C229 = CAP_ALU_MAL215099101E3: CAP - ALU 100uF 20% 50V - 1010; Current: 490mA; Mfg: Vishay Dale; Mfg Part Number: MAL215099101E3; HelpURL: http://www.vishay.com/docs/28395/150crz.pdf; CreatedBy: Jonathan Bouchard; Temperature: -55°C to 125°C; Power: *; Supplier 1: Digikey; Supplier Part Number 1: 4399PHDKR-ND; Precision: 20%
C221 C227 C230 C231 = CAP_CER: GRT31CR61H106KE01L / 1206 10uF 10% X5R Ceramic Capacitor; Mfr: Murata; Operating Temperature: -55C - 85C; Temperature Coefficient: X5R; ComponentLink1Description: Digikey; ComponentLink1URL: [Digikey Link]; ComponentLink2Description: Datasheet; ComponentLink2URL: [Datasheet Link]; Tolerance: 10%; Ratings: AEC-Q200; Part#: GRT31CR61H106KE01L
  C221 C230 C231: Supplier 1: Arrow Electronics; Supplier Part Number 1: GRT31CR61H106KE01L
C222 C232-C234 = CAP_CER: GCM155R71H104KE02J / 0402 100nF 10% X7R Ceramic Capacitor; Mfr: Murata; Operating Temperature: -55C - 125C; Temperature Coefficient: X7R; ComponentLink1Description: Digikey; ComponentLink1URL: [Digikey Link]; Part#: GCM155R71H104KE02J; ComponentLink2Description: Datasheet; ComponentLink2URL: [Datasheet Link]; Tolerance: 10%; Ratings: AEC-Q200
C223 C224 = CAP_CER: GRT31CR71H225KE13L / 1206 2.2uF 10% X7R Ceramic Capacitor; Mfr: Murata; Operating Temperature: -55C - 125C; Temperature Coefficient: X7R; ComponentLink1Description: Digikey; ComponentLink1URL: https://www.digikey.ca/en/products/detail/murata-electronics/GRT31CR71H225KE13L/10700891; Part#: GRT31CR71H225KE13L; ComponentLink2Description: Datasheet; ComponentLink2URL: https://search.murata.co.jp/Ceramy/image/img/A01X/G101/ENG/GRT31CR71H225KE13-01A.pdf; ComponentLink3Description: Octopart; ComponentLink3URL: https://octopart.com/grt31cr71h225ke13l-murata-76584457?r=sp; ComponentLink4Description: Murata; ComponentLink4URL: https://www.murata.com/en-us/products/productdetail?partno=GRT31CR71H225KE13%23; Tolerance: 10%; Ratings: AEC-Q200
D3 = DIODE_TVS: 53.3V Clamp 11.3A Ipp Tvs Diode Surface Mount SMB; Mfr: SMBJ33CAQ-13-F; Voltage - Reverse: 33V; Operating Temperature: *; Package / Case: SMB; Current: 11.3A; ComponentLink1Description: Digikey; ComponentLink1URL: https://www.digikey.ca/en/products/detail/diodes-incorporated/SMBJ33CAQ-13-F/9738859
D4 D5 = LED_SML-311UTT86: LED - 620nM RED 2mA - 0603; Voltage: 1.8V; Mfg: ROHM Semiconductor; Power: 44mW; Current: 2mA; HelpURL: http://media.digikey.com/pdf/Data%20Sheets/Rohm%20PDFs/SML-311%20Series.pdf; CreatedBy: Jonathan Bouchard; Temperature: -30°C to 85°C; Package: 0603; Precision: *; Mfg Part Number: SML-311UTT86; Supplier 1: Digikey; Supplier Part Number 1: 511-1304-1-ND
F1 = FUSE_HOLDER_3568: FUSE HOLDER BLADE; Mfr: Keystone; Voltage Rating: 500V; Current - Max: 30A; Operating Temperature: -50C - 145C; Created By: Pascal-Emmanuel Lachance
F2 = FUSE_0297010.WXNV: FUSE AUTO 10A 32V BLADE MINI; Mfr: Littelfuse; Current - Max: 40A; Time to Trip: 100ms; Resistance: 7.42mR; Rule: UNIONINDEX=0|RULEKIND=ComponentClearance|NETSCOPE=AnyNet|LAYERKIND=SameLayer|NAME=Schematic Component Clearance Constraint|GAP=-1mil|COLLISIONCHECKMODE=3|VERTICALGAP=10mil|SHOWDISTANCES=FALSE|UNIT=Imperial; Voltage Rating: 32V; Operating Temperature: -40C - 125C; Package / Case: BLADE MINI AUTO; Current - Hold: 10A; ComponentLink1Description: Datasheet; ComponentLink1URL: https://www.littelfuse.com/~/media/automotive/datasheets/fuses/passenger-car-and-commercial-vehicle/blade-fuses/littelfuse_mini_datasheet.pdf; ComponentLink2Description: Digikey; ComponentLink2URL: https://www.digikey.ca/en/products/detail/littelfuse-inc/0297010-WXNV/146591; Created By: Pascal-Emmanuel Lachance; ComponentLink3Description: Mouser; ComponentLink3URL: https://www.mouser.ca/ProductDetail/Littelfuse/0297010WXNV; ComponentLink4Description: Octopart; ComponentLink4URL: https://octopart.com/0297010.wxnv-littelfuse-566872
J5 = CON_MINIFIT_0039300060: CON - Mini-Fit Through Hole, Right Angle 6 position; Manufacturer #1: Molex; Current Rating: 8A; GRAMS Lib Spec: 2.8; Magnetic Material: Unknown; Polarized: Yes; Voltage Rating: 600V; Assembly Type: TH; CreatedBy/Date: Joel Lemay 2018-06-21; HelpURL: https://www.molex.com/pdm_docs/sd/039300060_sd.pdf; Manufacturer #2: *; Package: TH; Part Number #1: 0039300060; Part Number #2: *; Power Max: *; Supplier 1: Digi-Key; Supplier Part Number 1: WM21353-ND; Temperature: - 40°C to + 80°C; Tolerance: *; Value: *; VerifiedBy: Caroline Paulin - 10 sept 2018; Cryo: UNKNOWN
J6 = XT90: Current (Continuous): 90A; Resistance: 0.8 Ohm; Operating Temperature: -20C - 120C; Type: XT90
L1 L4 = INDUCTOR: Generic Inductor; Material: Metal Composite; Resistance: 25.5mR; Operating Temperature: -40C - 125C; Package / Case: Nonstandard; Ratings: AEC-Q200; Q @ Freq: -; ComponentLink1Description: Digikey; ComponentLink1URL: https://www.digikey.ca/en/products/detail/w%C3%BCrth-elektronik/74439346100/6236306; ComponentLink2Description: Datasheet; ComponentLink2URL: https://www.we-online.com/components/products/datasheet/74439346100.pdf; ComponentLink3Description: Octopart; ComponentLink3URL: https://octopart.com/74439346100-wurth+elektronik-75811204?r=sp; Supplier 1: Digikey; Supplier Part Number 1: 732-10707-1-ND
L2 L3 = IND_PLT10HH101150PNL: IND - 2 Line Common Mode Choke Surface Mount 100 Ohms @ 10MHz 15A DCR 2.3 mOhm - SMD (12.9mm L x 6.6mm W x 9.4mm H); Manufacturer #1: Murata Electronics North America; Voltage Rating: 300VDC; GRAMS Lib Spec: 2.8; Magnetic Material: Yes; Polarized: No; Cryo: UNKNOWN; Tolerance: *; Current Rating: 15A; Power Max: *; HelpURL: https://www.murata.com/en-eu/products/productdata/8796754935838/QFLB9101.pdf; CreatedBy/Date: Tommy Rossginol - 2019/04/09; VerifiedBy: Caroline Paulin - 10-04-2019; Temperature: -55°C ~ 125°C; Package: SMD (12.9mm L x 6.6mm W x 9.4mm H); Manufacturer #2: *; Assembly Type: SMD; Part Number #2: *; Part Number #1: PLT10HH101150PNL; Supplier 1: Digi-Key; Supplier Part Number 1: 490-12821-1-ND
NT38 NT39 = NET_TIE_SMALL
Q1 Q2 = P_CHANNEL: P-Channel 100 V 6.6A (Tc) 2.5W (Ta), 44W (Tc) Surface Mount TO-252AA; Mfr: onsemi; Vds: 100V; Rds ON: 530mΩ @ 3.3A,10V; Vgs: 4V @ 250µA; Vgs (max): 30V; Qualification: AEC-Q101; Package / Case: DPAK; Operating Temperature: -55C - 150C; ComponentLink1Description: Digikey; ComponentLink1URL: https://www.digikey.ca/en/products/detail/onsemi/FQD8P10TM-F085/2602606; ComponentLink2Description: Datasheet; ComponentLink2URL: https://www.onsemi.com/pdf/datasheet/fqd8p10tm_f085-d.pdf
R83 R84 R87 = RESISTOR: 1M 0402 1% 1/16W Resistor; Automotive: AEC-Q200; Operating Temperature: *; # Digikey: *; ComponentLink1Description: Digikey; ComponentLink1URL: *; # Manufacturer: *
R85 R86 R89-R93 = RESISTOR: Automotive: AEC-Q200; Operating Temperature: *; # Digikey: *; ComponentLink1Description: Digikey; ComponentLink1URL: *; # Manufacturer: *
R88 = RESISTOR: CSRN2512FK30L0; Automotive: AEC-Q200; Operating Temperature: -55C - 155C; ComponentLink1Description: Digikey; ComponentLink1URL: https://www.digikey.ca/fr/products/detail/stackpole-electronics-inc/CSRN2512FK30L0/1646107; Part #: CSRN2512FK30L0
SW1 = SPDT_SWITCH: 1103M2S3CQE2 / Slide Switch SPDT Through Hole; Mfr: C&K; Switch Function: On-Off-On; Current Rating: 6A; Voltage Rating - AC: 120V; Voltage Rating - DC: 28V; Cycles: 40000; Operating Temperature: -30C - 65C; ComponentLink1Description: Digikey; ComponentLink1URL: https://www.digikey.ca/en/products/detail/c-k/1103M2S3CQE2/483721; ComponentLink2Description: Datasheet; ComponentLink2URL: https://www.ckswitches.com/media/1429/1000.pdf; ComponentLink3Description: Octopart; ComponentLink3URL: https://octopart.com/1103m2s3cqe2-c%26k+components-2492778?r=sp; Supplier 1: Arrow Electronics; Supplier Part Number 1: 1103M2S3CQE2
TP25 TP29 TP30 TP33-TP36 = TESTPOINT: Test Point; ClassName: Testpoint
TP26-TP28 TP31 TP32 = TESTPOINT_PAD: Test Point
U7 = IRE-24/5-Q12P-C: Isolated DC/DC Converters - Through Hole 9V-36VIN 24VOUT 120W; Mfr: Murata; Voltage - Output: 12V; Current - Output: 10A; Voltage - Input (Min): 9V; Voltage - Input (Max): 36V; Isolation Voltage: 2.828kV; Switching Frequency: 240kHz; Output Power: 120W; Operating Temperature: -40C - 85C; ComponentLink1Description: Mouser; ComponentLink1URL: https://www.mouser.ca/ProductDetail/Murata-Power-Solutions/IRE-12-10-Q12NF-C?qs=xZ%2FP%252Ba9zWqYdIxrb6V0e3g%3D%3D; ComponentLink2Description: Murata; ComponentLink2URL: https://www.murata.com/en-us/products/productdetail?partno=IRE-12%2F10-Q12P-C; ComponentLink3Description: Datasheet; ComponentLink3URL: https://www.murata.com/products/productdata/8807029112862/ire-q12.pdf?1655388012000; ComponentLink4Description: Octopart; ComponentLink4URL: https://octopart.com/ire-12%2F10-q12nf-c-murata+power+solutions-107236518?r=sp; Supplier 1: Digikey; Supplier Part Number 1: 811-IRE-12/10-Q12P-C-ND; ComponentLink5Description: Digikey; ComponentLink5URL: https://www.digikey.ca/en/products/detail/murata-power-solutions-inc/IRE-12-10-Q12P-C/11503740
WA1 = UND_GST280A24-C6P: UND - AC/DC DESKTOP ADAPTER 24V 280W - MEC; Manufacturer #1: MEAN WELL USA Inc.; Tolerance: ±3%; Voltage Rating: 85~264VAC; GRAMS Lib Spec: 2.8; Magnetic Material: Unknown; Polarized: Yes; Power Max: 280W; HelpURL: https://www.meanwell.com/Upload/PDF/GST280A/GST280A-SPEC.PDF; CreatedBy/Date: Caroline Paulin - 5 avril 2019; VerifiedBy: Nicolas V. (2019-07-05); Temperature: -30°C to +70°C; Package: -; Manufacturer #2: *; Note: *; Assembly Type: -; Part Number #2: *; Part Number #1: GST280A24-C6P; Supplier 1: Digi-Key; Supplier Part Number 1: 1866-2122-ND; Cryo: UNKNOWN
U8 = NCV2931ADT5.0RKG: Supplier 1: Mouser; Supplier Part Number 1: 863-NCV2931ADT5.0RKG; ComponentLink1Description: Digikey; ComponentLink1URL: https://www.digikey.com/en/products/detail/onsemi/NCV2931ADT5-0RKG/1961138